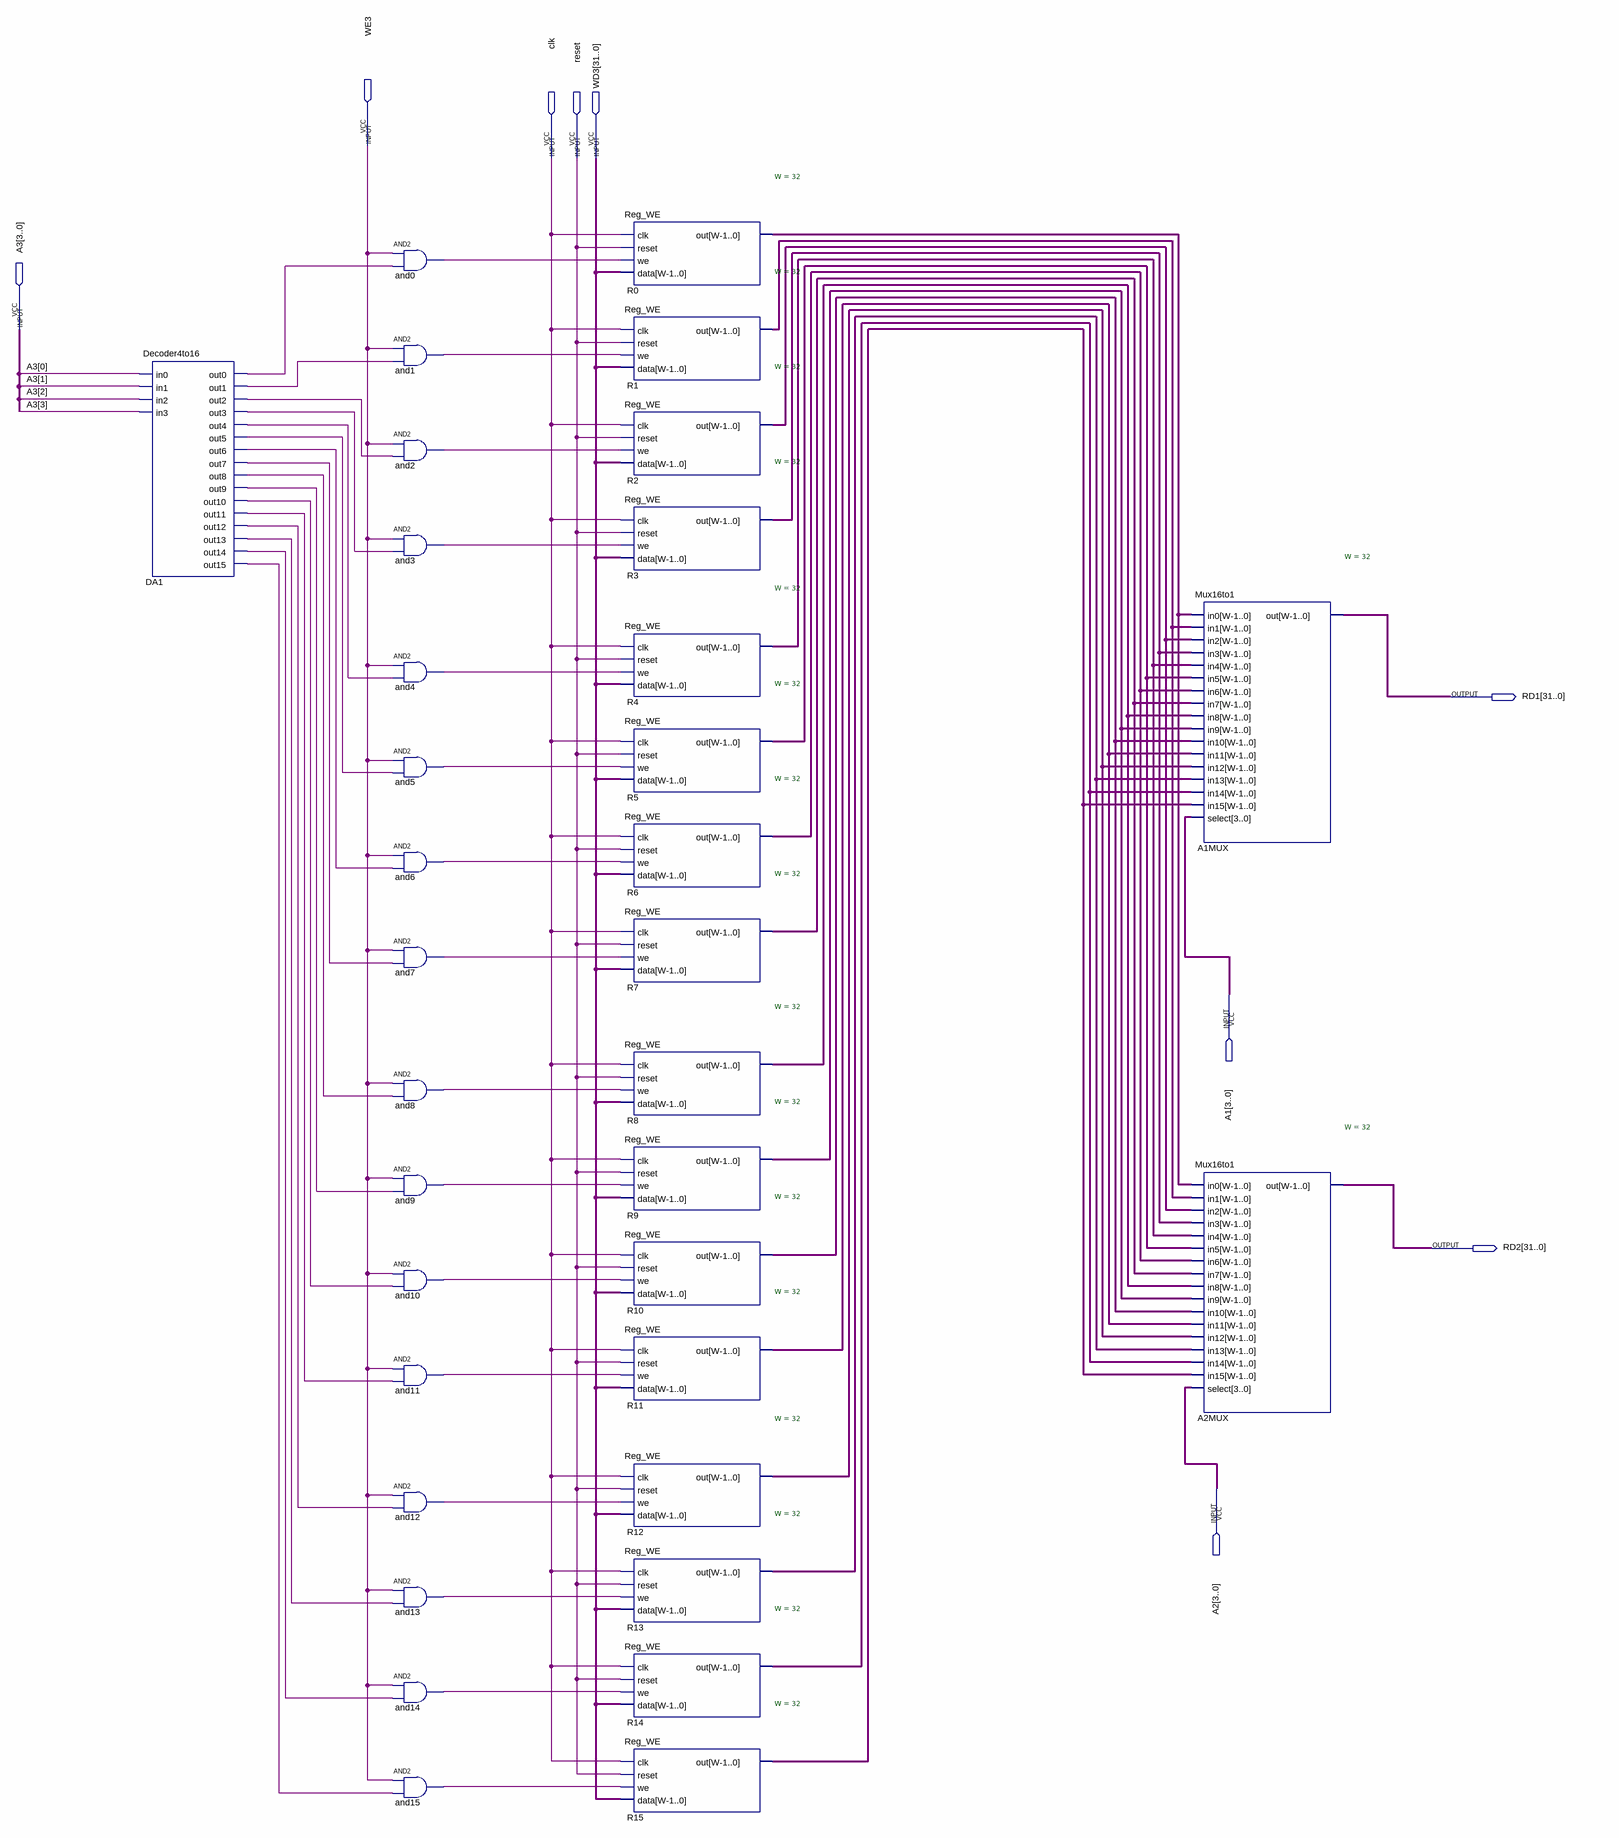
[diagram p0: schematic sheet]
// Quartus schematic RF.bdf as structural Verilog: 35 symbols, 9 pins
module RF (
  input  WE3,
  input  clk,
  input  reset,
  input  [31:0] WD3,
  input  [3:0] A3,
  input  [3:0] A1,
  input  [3:0] A2,
  output [31:0] RD1,
  output [31:0] RD2
);

  wire and0_out, and1_out, and2_out, and3_out, and4_out, and5_out, and6_out, and7_out, and8_out, and9_out,
       and10_out, and11_out, and12_out, and13_out, and14_out, and15_out, DA1_out0, DA1_out1, DA1_out2,
       DA1_out3, DA1_out4, DA1_out5, DA1_out6, DA1_out7, DA1_out8, DA1_out9, DA1_out10, DA1_out11, DA1_out12,
       DA1_out13, DA1_out14, DA1_out15;
  wire [31:0] R0_out, R1_out, R2_out, R3_out, R4_out, R5_out, R6_out, R7_out, R8_out, R9_out, R10_out,
       R11_out, R12_out, R13_out, R14_out, R15_out;

  Decoder4to16 DA1 (
    .in0(A3[0]), .in1(A3[1]), .in2(A3[2]), .in3(A3[3]), .out0(DA1_out0), .out1(DA1_out1), .out2(DA1_out2),
    .out3(DA1_out3), .out4(DA1_out4), .out5(DA1_out5), .out6(DA1_out6), .out7(DA1_out7), .out8(DA1_out8),
    .out9(DA1_out9), .out10(DA1_out10), .out11(DA1_out11), .out12(DA1_out12), .out13(DA1_out13),
    .out14(DA1_out14), .out15(DA1_out15));
  and and0 (and0_out, WE3, DA1_out0);
  and and1 (and1_out, WE3, DA1_out1);
  and and2 (and2_out, WE3, DA1_out2);
  and and3 (and3_out, WE3, DA1_out3);
  and and4 (and4_out, WE3, DA1_out4);
  and and5 (and5_out, WE3, DA1_out5);
  and and6 (and6_out, WE3, DA1_out6);
  and and7 (and7_out, WE3, DA1_out7);
  and and8 (and8_out, WE3, DA1_out8);
  and and9 (and9_out, WE3, DA1_out9);
  and and10 (and10_out, WE3, DA1_out10);
  and and11 (and11_out, WE3, DA1_out11);
  and and12 (and12_out, WE3, DA1_out12);
  and and13 (and13_out, WE3, DA1_out13);
  and and14 (and14_out, WE3, DA1_out14);
  and and15 (and15_out, WE3, DA1_out15);
  Reg_WE #(.W(32)) R0 (.clk(clk), .reset(reset), .we(and0_out), .data(WD3), .out(R0_out));
  Reg_WE #(.W(32)) R1 (.clk(clk), .reset(reset), .we(and1_out), .data(WD3), .out(R1_out));
  Reg_WE #(.W(32)) R2 (.clk(clk), .reset(reset), .we(and2_out), .data(WD3), .out(R2_out));
  Reg_WE #(.W(32)) R3 (.clk(clk), .reset(reset), .we(and3_out), .data(WD3), .out(R3_out));
  Reg_WE #(.W(32)) R4 (.clk(clk), .reset(reset), .we(and4_out), .data(WD3), .out(R4_out));
  Reg_WE #(.W(32)) R5 (.clk(clk), .reset(reset), .we(and5_out), .data(WD3), .out(R5_out));
  Reg_WE #(.W(32)) R6 (.clk(clk), .reset(reset), .we(and6_out), .data(WD3), .out(R6_out));
  Reg_WE #(.W(32)) R7 (.clk(clk), .reset(reset), .we(and7_out), .data(WD3), .out(R7_out));
  Reg_WE #(.W(32)) R8 (.clk(clk), .reset(reset), .we(and8_out), .data(WD3), .out(R8_out));
  Reg_WE #(.W(32)) R9 (.clk(clk), .reset(reset), .we(and9_out), .data(WD3), .out(R9_out));
  Reg_WE #(.W(32)) R10 (.clk(clk), .reset(reset), .we(and10_out), .data(WD3), .out(R10_out));
  Reg_WE #(.W(32)) R11 (.clk(clk), .reset(reset), .we(and11_out), .data(WD3), .out(R11_out));
  Reg_WE #(.W(32)) R12 (.clk(clk), .reset(reset), .we(and12_out), .data(WD3), .out(R12_out));
  Reg_WE #(.W(32)) R13 (.clk(clk), .reset(reset), .we(and13_out), .data(WD3), .out(R13_out));
  Reg_WE #(.W(32)) R14 (.clk(clk), .reset(reset), .we(and14_out), .data(WD3), .out(R14_out));
  Reg_WE #(.W(32)) R15 (.clk(clk), .reset(reset), .we(and15_out), .data(WD3), .out(R15_out));
  Mux16to1 #(.W(32)) A1MUX (
    .in0(R0_out), .in1(R1_out), .in2(R2_out), .in3(R3_out), .in4(R4_out), .in5(R5_out), .in6(R6_out),
    .in7(R7_out), .in8(R8_out), .in9(R9_out), .in10(R10_out), .in11(R11_out), .in12(R12_out), .in13(R13_out),
    .in14(R14_out), .in15(R15_out), .select(A1), .out(RD1));
  Mux16to1 #(.W(32)) A2MUX (
    .in0(R0_out), .in1(R1_out), .in2(R2_out), .in3(R3_out), .in4(R4_out), .in5(R5_out), .in6(R6_out),
    .in7(R7_out), .in8(R8_out), .in9(R9_out), .in10(R10_out), .in11(R11_out), .in12(R12_out), .in13(R13_out),
    .in14(R14_out), .in15(R15_out), .select(A2), .out(RD2));
endmodule
